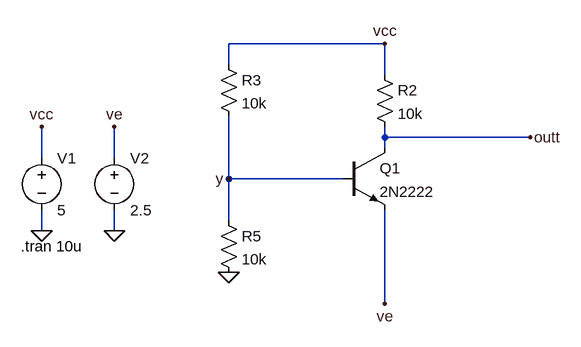
[diagram p0: schematic test.asc]
test.asc, the LTspice schematic file:
Version 4
SHEET 1 1976 1036
WIRE 176 -32 -64 -32
WIRE -64 0 -64 -32
WIRE 176 16 176 -32
WIRE 176 112 176 96
WIRE 400 112 176 112
WIRE 176 128 176 112
WIRE -352 144 -352 96
WIRE -240 144 -240 96
WIRE -64 176 -64 80
WIRE 112 176 -64 176
WIRE -64 240 -64 176
WIRE -352 256 -352 224
WIRE -240 256 -240 224
WIRE 176 368 176 224
FLAG -352 256 0
FLAG -240 256 0
FLAG -352 96 vcc
FLAG -240 96 ve
FLAG 176 -32 vcc
FLAG -64 320 0
FLAG 176 368 ve
FLAG 400 112 outt
FLAG -64 176 y
SYMBOL npn 112 128 R0
SYMATTR InstName Q1
SYMATTR Value 2N2222
SYMBOL voltage -352 128 R0
WINDOW 123 0 0 Left 0
WINDOW 39 0 0 Left 0
SYMATTR InstName V1
SYMATTR Value 5
SYMBOL res 160 0 R0
SYMATTR InstName R2
SYMATTR Value 10k
SYMBOL res -80 -16 R0
SYMATTR InstName R3
SYMATTR Value 10k
SYMBOL res -80 224 R0
SYMATTR InstName R5
SYMATTR Value 10k
SYMBOL voltage -240 128 R0
WINDOW 123 0 0 Left 0
WINDOW 39 0 0 Left 0
SYMATTR InstName V2
SYMATTR Value 2.5
TEXT -384 280 Left 2 !.tran 10u

The netlist it stands for:
* test.asc
Q1 outt y ve 0 2N2222
V1 vcc 0 5
R2 vcc outt 10k
R3 vcc y 10k
R5 y 0 10k
V2 ve 0 2.5
.model NPN NPN
.model PNP PNP
.lib standard.bjt
.tran 10u
.backanno
.end

* Results of the author's LTspice run, read from the files saved beside the schematic
* Operating Point, zero values left out:
*   V(outt) = 5 V
*   V(y) = 2.5 V
*   V(ve) = 2.5 V
*   V(vcc) = 5 V
*   Ic(Q1) = 2.517 pA
*   Ib(Q1) = -2.503 pA
*   I(R5) = 250 µA
*   I(R3) = 250 µA
*   I(R2) = 2.516 pA
*   I(V1) = -250 µA